# EAGLE design ArudinoShield (EAGLE 9.5.0)
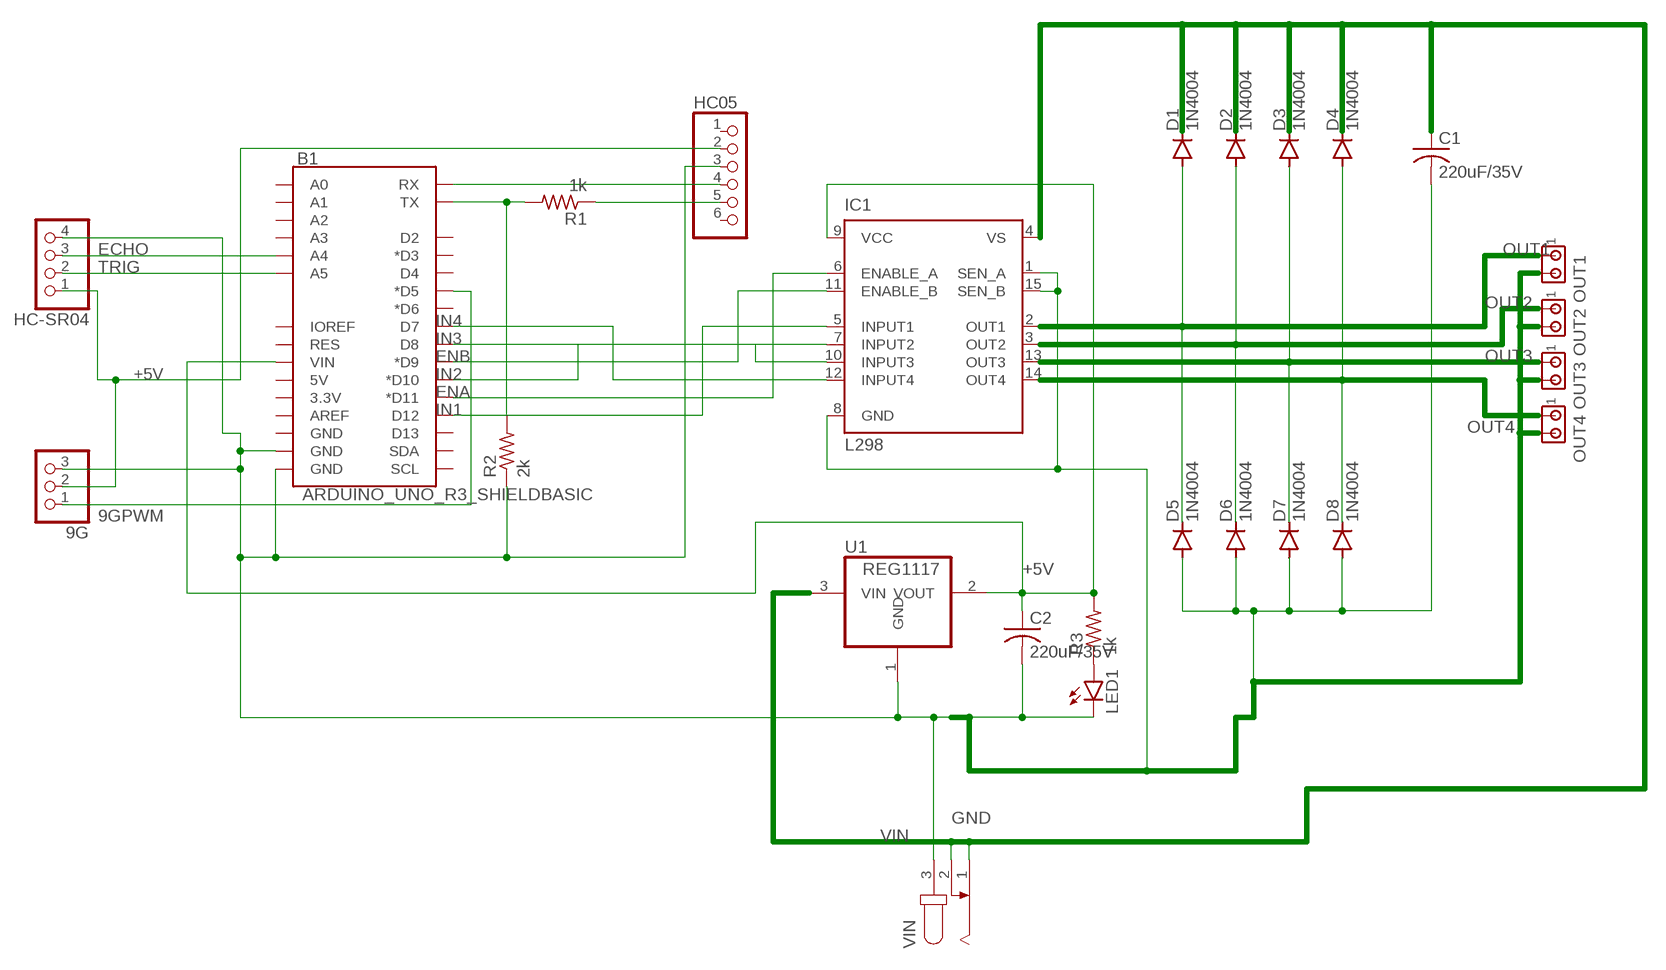
[diagram p0: schematic, sheet 1]

## Parts
9G  PINHD-1X3  [1X03]
B1  ARDUINO_UNO_R3_SHIELDBASIC  [UNO_R3_SHIELD]
C1  220uF/35V  C-US050-024X044  [C050-024X044]
C2  220uF/35V  C-US050-024X044  [C050-024X044]
D1  1N4004  [DO41-10]
D2  1N4004  [DO41-10]
D3  1N4004  [DO41-10]
D4  1N4004  [DO41-10]
D5  1N4004  [DO41-10]
D6  1N4004  [DO41-10]
D7  1N4004  [DO41-10]
D8  1N4004  [DO41-10]
HC05  PINHD-1X6/90  [1X06/90]
HC-SR04  PINHD-1X4  [1X04]
IC1  L298  [MULTIWATT-15]
LED1  LED5MM  [LED5MM]
OUT1  MTA02-156  [1X2MTA]
OUT2  MTA02-156  [1X2MTA]
OUT3  MTA02-156  [1X2MTA]
OUT4  MTA02-156  [1X2MTA]
R1  1k  R-US_0207/10  [0207/10]
R2  2k  R-US_0207/10  [0207/10]
R3  1k  R-US_0207/10  [0207/10]
U1  REG1117  [SOT223]
VIN  JACK-PLUG1  [SPC4078]

## Nets
9GPWM: 9G.1 B1.D5(*D5)
+5V: 9G.2 B1.VIN C2.1 HC05.2 HC-SR04.1 IC1.9(VCC) R3.2 U1.2(VOUT)
ECHO: B1.A4 HC-SR04.3
ENA: B1.D11(*D11) IC1.6(ENABLE_A)
ENB: B1.D9(*D9) IC1.11(ENABLE_B)
GND: 9G.3 B1.GND@0(GND) B1.GND@1(GND) C1.2 C2.2 D5.A D6.A D7.A D8.A HC05.3 HC-SR04.4 IC1.1(SEN_A) IC1.8(GND) IC1.15(SEN_B) LED1.K(C) OUT1.2 OUT2.2 OUT3.2 OUT4.2 R2.1 U1.1(GND) VIN.3
IN1: B1.D12 IC1.5(INPUT1)
IN2: B1.D10(*D10) IC1.7(INPUT2)
IN3: B1.D8 IC1.10(INPUT3)
IN4: B1.D7 IC1.12(INPUT4)
N$11: B1.TX R1.2 R2.2
N$12: B1.RX HC05.4
N$14: HC05.5 R1.1
N$25: LED1.A R3.1
OUT1: D1.A D5.C IC1.2(OUT1) OUT1.1
OUT2: D2.A D6.C IC1.3(OUT2) OUT2.1
OUT3: D3.A D7.C IC1.13(OUT3) OUT3.1
OUT4: D4.A D8.C IC1.14(OUT4) OUT4.1
TRIG: B1.A5 HC-SR04.2
VIN: C1.1 D1.C D2.C D3.C D4.C IC1.4(VS) U1.3(VIN) VIN.1 VIN.2
Unconnected: B1.3.3V B1.5V B1.A0 B1.A1 B1.A2 B1.A3 B1.AREF B1.D2 B1.D3(*D3) B1.D4 B1.D6(*D6) B1.D13 B1.GND@2(GND) B1.IOREF B1.RES B1.SCL B1.SDA HC05.1 HC05.6

## Library data of the parts
9G = pinhead:PINHD-1X3: PIN HEADER
B1 = SparkFun-Boards:ARDUINO_UNO_R3_SHIELD: Arduino R3 Shield Footprint Shield form compatible with the Arduino Uno R3. SparkFun Products: MG2639 Cellular Shield <https://www.sparkfun.com/products/13120> MIDI Shield <https://www.sparkfun.com/products/12898> R3 Stackable Headers Kit <https://www.sparkfun.com/products/11417>
C1 C2 = rcl:C-US: CAPACITOR, American symbol; SPICEPREFIX: C
D1-D8 = diode:1N4004: DIODE general purpose rectifier, 1 A
HC05 = pinhead:PINHD-1X6: PIN HEADER
HC-SR04 = pinhead:PINHD-1X4: PIN HEADER
IC1 = st-microelectronics:L298: DUAL FULL-BRIDGE DRIVER; MPN: L298N; OC_FARNELL: 1589425; OC_NEWARK: 32M1527
LED1 = led:LED: LED OSRAM: - CHIPLED LG R971, LG N971, LY N971, LG Q971, LY Q971, LO R971, LY R971 LH N974, LH R974 LS Q976, LO Q976, LY Q976 LO Q996 - Hyper CHIPLED LW Q18S LB Q993, LB Q99A, LB R99A - SideLED LS A670, LO A670, LY A670, LG A670, LP A670 LB A673, LV A673, LT A673, LW A673 LH A674 LY A675 LS A676, LA A676, LO A676, LY A676, LW A676 LS A679, LY A679, LG A679 - Hyper Micro SIDELED® LS Y876, LA Y876, LO Y876, LY Y876 LT Y87S - SmartLED LW L88C, LW L88S LB L89C, LB L89S, LG L890 LS L89K, LO L89K, LY L89K LS L896, LA L896, LO L896, LY L896 - TOPLED LS T670, LO T670, LY T670, LG T670, LP T670 LSG T670, LSP T670, LSY T670, LOP T670, LYG T670 LG T671, LOG T671, LSG T671 LB T673, LV T673, LT T673, LW T673 LH T674 LS T676, LA T676, LO T676, LY T676, LB T676, LH T676, LSB T676, LW T676 LB T67C, LV T67C, LT T67C, LS T67K, LO T67K, LY T67K, LW E67C LS E67B, LA E67B, LO E67B, LY E67B, LB E67C, LV E67C, LT E67C LW T67C LS T679, LY T679, LG T679 LS T770, LO T770, LY T770, LG T770, LP T770 LB T773, LV T773, LT T773, LW T773 LH T774 LS E675, LA E675, LY E675, LS T675 LS T776, LA T776, LO T776, LY T776, LB T776 LHGB T686 LT T68C, LB T68C - Hyper Mini TOPLED® LB M676 - Mini TOPLED Santana® LG M470 LS M47K, LO M47K, LY M47K Source: http://www.osram.convergy.de LUXEON: - LUMILED® LXK2-PW12-R00, LXK2-PW12-S00, LXK2-PW14-U00, LXK2-PW14-V00 LXK2-PM12-R00, LXK2-PM12-S00, LXK2-PM14-U00 LXK2-PE12-Q00, LXK2-PE12-R00, LXK2-PE12-S00, LXK2-PE14-T00, LXK2-PE14-U00 LXK2-PB12-K00, LXK2-PB12-L00, LXK2-PB12-M00, LXK2-PB14-N00, LXK2-PB14-P00, LXK2-PB14-Q00 LXK2-PR12-L00, LXK2-PR12-M00, LXK2-PR14-Q00, LXK2-PR14-R00 LXK2-PD12-Q00, LXK2-PD12-R00, LXK2-PD12-S00 LXK2-PH12-R00, LXK2-PH12-S00 LXK2-PL12-P00, LXK2-PL12-Q00, LXK2-PL12-R00 Source: www.luxeon.com KINGBRIGHT: KA-3528ASYC Source: www.kingbright.com
OUT1-OUT4 = con-amp:MTA02-156: AMP connector
R1-R3 = rcl:R-US_: RESISTOR, American symbol; SPICEPREFIX: R
U1 = burr-brown:REG1117: 800mA and 1A Low Dropout (LDO) Positive Regulator 1.8V, 2.5V, 2.85V, 3.3V, 5V, and Adj; MPN: REG1117; OC_FARNELL: 1097566; OC_NEWARK: 14P6981
VIN = con-jack:JACK-PLUG: DC POWER JACK Power Jack, DC, Right Angle, Through Hole, Rated 5A at 16VDC, PC Terminals Distributor: Farnell (www.Farnell.de) Drawing: 84N1161.pdf / 84N1162.pdf Manufacturer: SPC Technology (www.spctechnology.com) Type: SPC4077 / SPC 4078; OC_FARNELL: unknown; OC_NEWARK: unknown

## Board
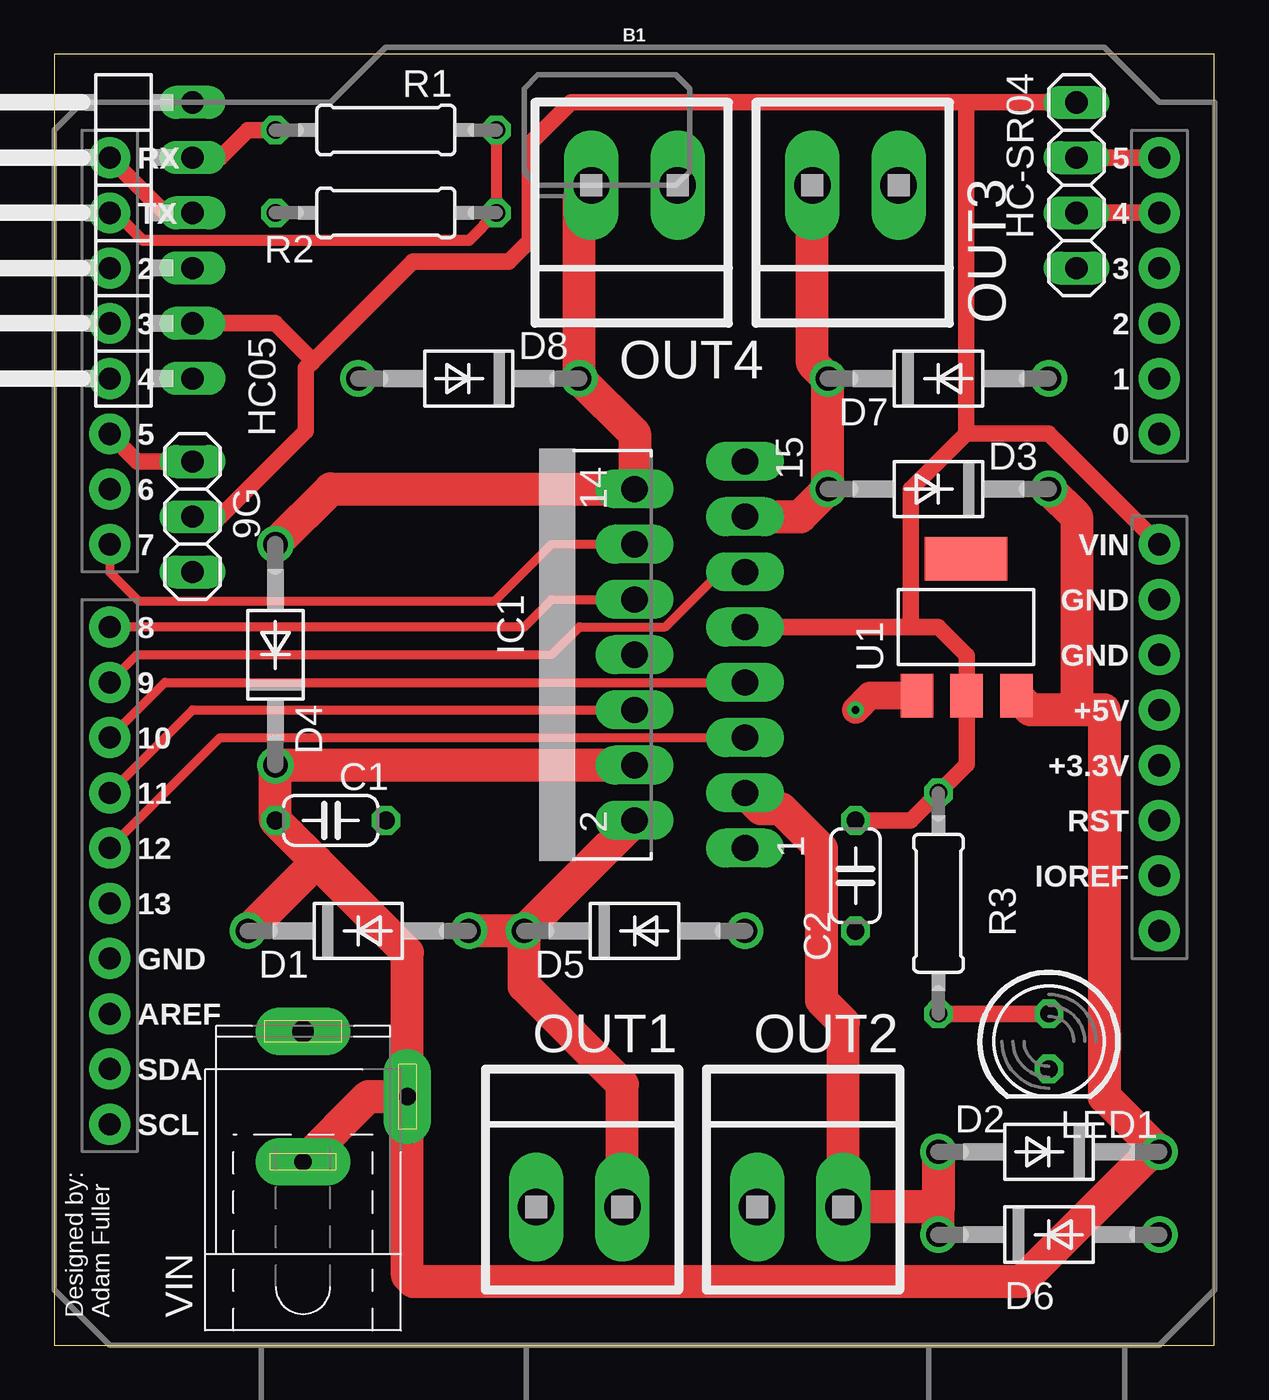
[diagram p1: board, top side]
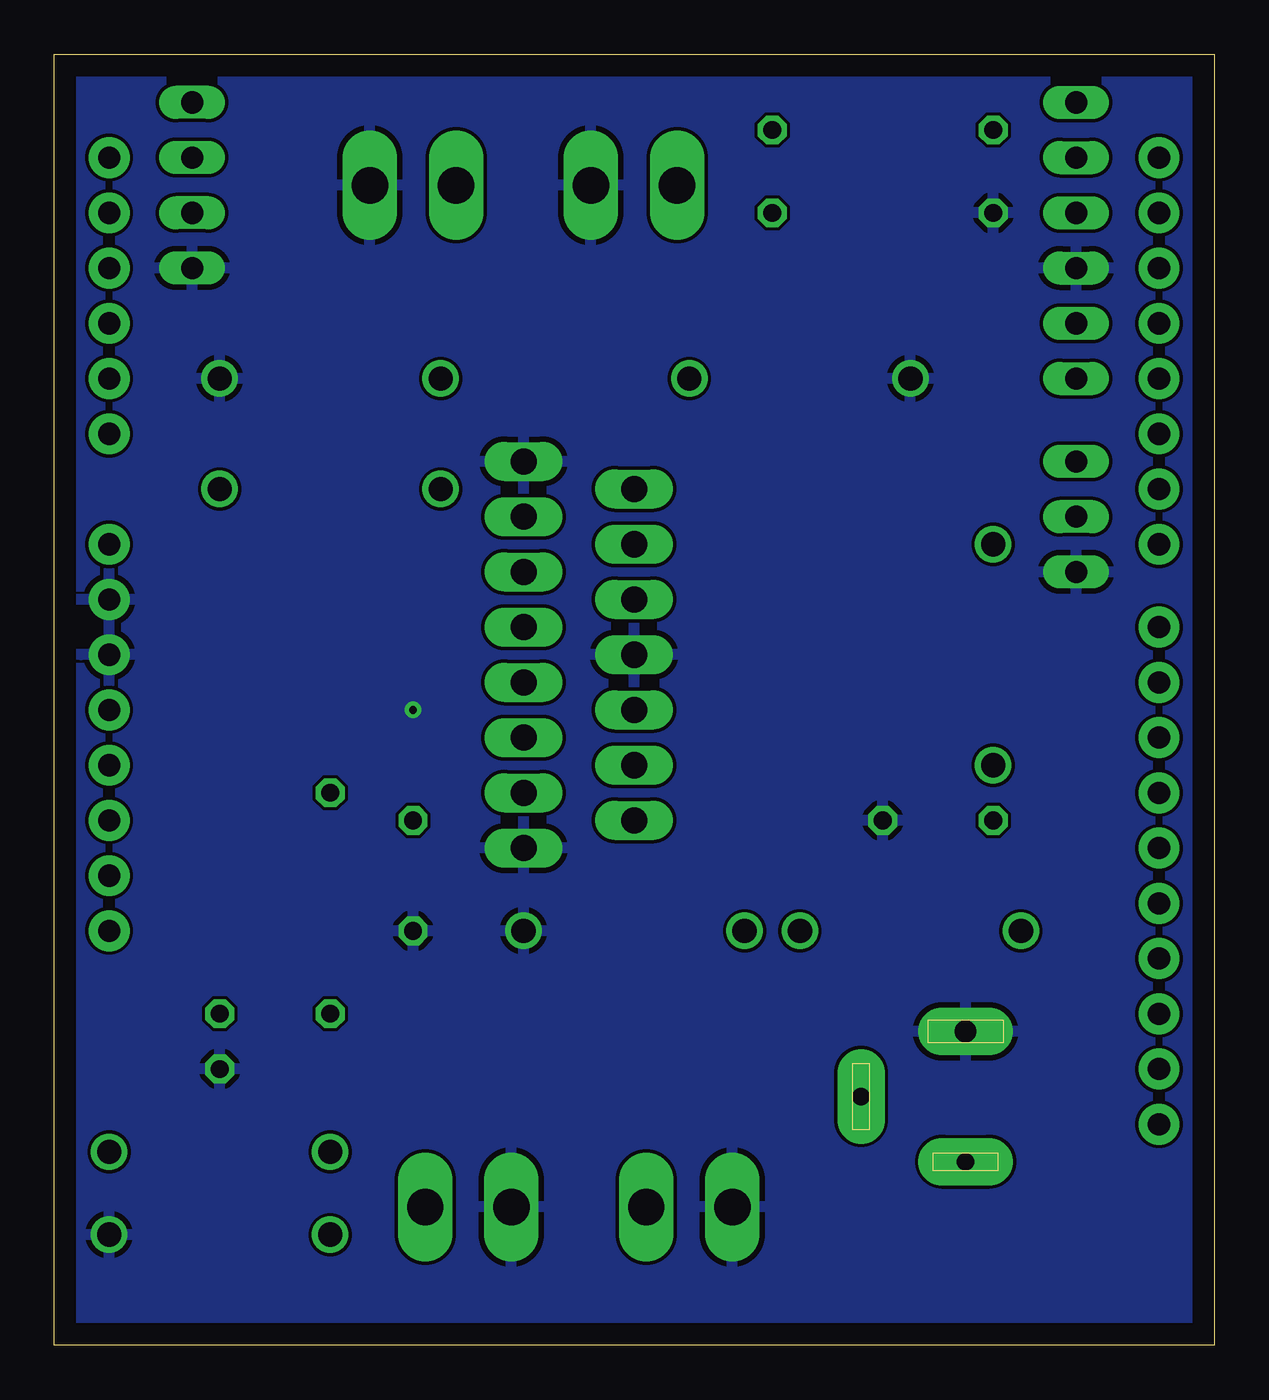
[diagram p2: board, bottom side, seen from below]

Size 53.32 x 59.36 mm. Coordinates in mm from the lower left corner, seen from the top.
Outline: 0,0 53.32,0 53.32,59.36 0,59.36 0,0
Copper layers (1*16): Top 0.035mm / dielectric 1.5mm / Bottom 0.035mm
Design rules "default *": minimum track width 16mil, minimum drill 0.35mm, track to track 6mil, track to pad 6mil, pad to pad 10mil, via to via 10mil, smd to smd 6mil, copper to edge 40mil, drill to drill 16mil, minimum pad ring 10mil, minimum via ring 8mil, stop-mask expansion 4mil, vias tented up to drill 0mil, thermal gap 10mil

### Footprints (pad centres in the part's own frame; a part is rotated, then mirrored left to right if it is on the bottom)
1X03 = drill 1.016 long: 1 -2.54,0; 2 0,0; 3 2.54,0
UNO_R3_SHIELD = drill 1.016 pad 1.88: 3.3V 24.13,-2.54; 5V 24.13,0; A0 24.13,12.7; A1 24.13,15.24; A2 24.13,17.78; A3 24.13,20.32; A4 24.13,22.86; A5 24.13,25.4; AREF -24.13,-13.97; D2 -24.13,20.32; D3 -24.13,17.78; D4 -24.13,15.24; D5 -24.13,12.7; D6 -24.13,10.16; D7 -24.13,7.62; D8 -24.13,3.81; D9 -24.13,1.27; D10 -24.13,-1.27; D11 -24.13,-3.81; D12 -24.13,-6.35; D13 -24.13,-8.89; GND@0 24.13,2.54; GND@1 24.13,5.08; GND@2 -24.13,-11.43; IOREF 24.13,-7.62; NC 24.13,-10.16; RES 24.13,-5.08; RX -24.13,25.4; SCL -24.13,-19.05; SDA -24.13,-16.51; TX -24.13,22.86; VIN 24.13,7.62
C050-024X044 = drill 0.813 octagon: 1 -2.54,0; 2 2.54,0
DO41-10 = drill 1.118: A 5.08,0; C -5.08,0
1X06/90 = drill 1.016 long: 1 -6.35,-3.81; 2 -3.81,-3.81; 3 -1.27,-3.81; 4 1.27,-3.81; 5 3.81,-3.81; 6 6.35,-3.81
1X04 = drill 1.016 long: 1 -3.81,0; 2 -1.27,0; 3 1.27,0; 4 3.81,0
MULTIWATT-15 = drill 1.2 long: 1 -8.89,-7.62; 2 -7.62,-2.54; 3 -6.35,-7.62; 4 -5.08,-2.54; 5 -3.81,-7.62; 6 -2.54,-2.54; 7 -1.27,-7.62; 8 0,-2.54; 9 1.27,-7.62; 10 2.54,-2.54; 11 3.81,-7.62; 12 5.08,-2.54; 13 6.35,-7.62; 14 7.62,-2.54; 15 8.89,-7.62
LED5MM = drill 0.813 octagon: A -1.27,0; K 1.27,0
1X2MTA = drill 1.676 long: 1 1.981,0; 2 -1.981,0
0207/10 = drill 0.813 octagon: 1 -5.08,0; 2 5.08,0
SOT223 = smd 1.499 x 2.007: 1 -2.261,-3.15; 2 0.025,-3.15; 3 2.311,-3.15 | smd 3.81 x 2.007: 4 0,3.15
SPC4078 = drill 0.8 pad 2.184 long: 1 -3,0; 2 0,-4.8 | drill 1 pad 2.184 long: 3 3,0

### Placement (x,y rotation side)
9G  6.35,38.1 270 top
B1  26.67,29.21 0 top
C1  12.7,24.13 0 top
C2  36.83,21.59 270 top
D1  13.97,19.05 0 top
D2  45.72,8.89 180 top
D3  40.64,39.37 180 top
D4  10.16,31.75 90 top
D5  26.67,19.05 0 top
D6  45.72,5.08 0 top
D7  40.64,44.45 0 top
D8  19.05,44.45 180 top
HC05  2.54,50.8 90 top
HC-SR04  46.99,53.34 270 top
IC1  24.13,31.75 90 top
LED1  45.72,13.97 270 top
OUT1  24.13,6.35 0 top
OUT2  34.29,6.35 0 top
OUT3  36.83,53.34 180 top
OUT4  26.67,53.34 180 top
R1  15.24,55.88 0 top
R2  15.24,52.07 0 top
R3  40.64,20.32 90 top
U1  41.91,33.02 0 top
VIN  11.43,11.43 90 top

### Tracks (layer width: path | path; a pad name or v marks a point on that pad's centre or on a via)
9GPWM
  Top 0.762: 9G.1 3.81,40.64 B1.D5
+5V
  Top 0.762: 9G.2 7.62,38.1 11.56,42.04 11.56,44.92 11.89,45.26 | 11.89,45.26 16.47,49.84 20.89,49.84 21.86,50.8 21.86,55.24 23.76,57.15 41.91,57.15 | HC05.2 10.16,46.99 11.89,45.26 | 39.37,33.02 39.37,39.37 41.91,41.91 | B1.VIN 45.72,41.91 41.91,41.91 | 39.37,33.02 IC1.9 | C2.1 39.37,24.13 R3.2 41.93,26.69 U1.2 41.93,31.72 40.64,33.02 39.37,33.02 | 41.91,41.91 41.91,57.15 | 41.91,57.15 HC-SR04.1
ECHO
  Top 0.762: HC-SR04.3 B1.A4
ENA
  Top 0.406: B1.D11 6.35,29.21 IC1.6
ENB
  Top 0.406: B1.D9 3.81,31.75 22.86,31.75 24.14,33.03 28.09,33.03 30.62,35.56 IC1.11
GND  (via drill 0.35)
  Top 1.27: v36.83,29.21 37.49,29.87 U1.1
  pour Bottom: 0,59.69 53.34,59.69 53.34,0 0,0
IN1
  Top 0.406: B1.D12 7.62,27.94 IC1.5
IN2
  Top 0.406: B1.D10 5.08,30.48 IC1.7
IN3
  Top 0.406: IC1.10 22.86,34.29 21.59,33.02 B1.D8
IN4
  Top 0.406: B1.D7 2.54,35.56 3.88,34.22 20.26,34.22 22.86,36.83 IC1.12
N$11
  Top 0.508: R1.2 R2.2 19.05,50.8 4.08,50.8 2.81,52.07 B1.TX
N$12
  Top 0.762: HC05.4 5.08,52.07 B1.RX
N$14
  Top 0.762: HC05.5 7.62,54.61 8.89,55.88 R1.1
N$25
  Top 0.762: LED1.A R3.1
OUT1
  Top 1.524: D5.C D1.A | IC1.2 D5.C | OUT1.1 26.11,11.99 21.59,16.51 D5.C
OUT2
  Top 1.524: IC1.3 32.48,24.67 33.4,24.67 35.26,22.82 35.26,15.86 36.27,14.84 OUT2.1 40.64,6.35 | D2.A 40.64,6.35 | D6.C 40.64,6.35
OUT3
  Top 1.524: IC1.13 34.29,38.1 D3.A D7.C 34.85,45.16 OUT3.1
OUT4
  Top 1.524: OUT4.1 24.13,52.78 D8.C 26.67,41.91 IC1.14 12.7,39.37 D4.A
TRIG
  Top 0.762: HC-SR04.2 B1.A5
VIN
  Top 1.27: 50.42,8.89 D2.C
  Top 1.524: IC1.4 D4.C C1.1 12.06,22.22 | D2.C 48.26,11.43 48.26,29.21 46.99,29.21 | D3.C 46.99,38.1 46.99,29.21 | U1.3 44.88,29.21 46.99,29.21 | 50.42,8.89 44.45,2.92 19.05,2.92 | 19.05,2.92 16.51,2.92 16.23,3.2 VIN.2 | VIN.1 14.43,11.43 VIN.2 | VIN.2 16.23,18.06 12.06,22.22 | D1.C 12.06,22.22 | 19.05,2.92

### Text on the board
tPlace: Designed by: / Adam Fuller